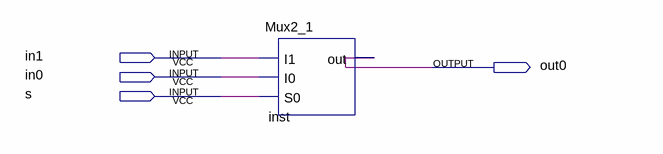
[diagram p0: schematic sheet]
// Quartus schematic MuxDemo.bdf as structural Verilog: 1 symbols, 4 pins
module MuxDemo (
  input  in1,
  input  in0,
  input  s,
  output out0
);

  Mux2_1 inst (.I1(in1), .I0(in0), .S0(s), .out(out0));
endmodule
